# EAGLE design test1 (EAGLE 6.5.0)
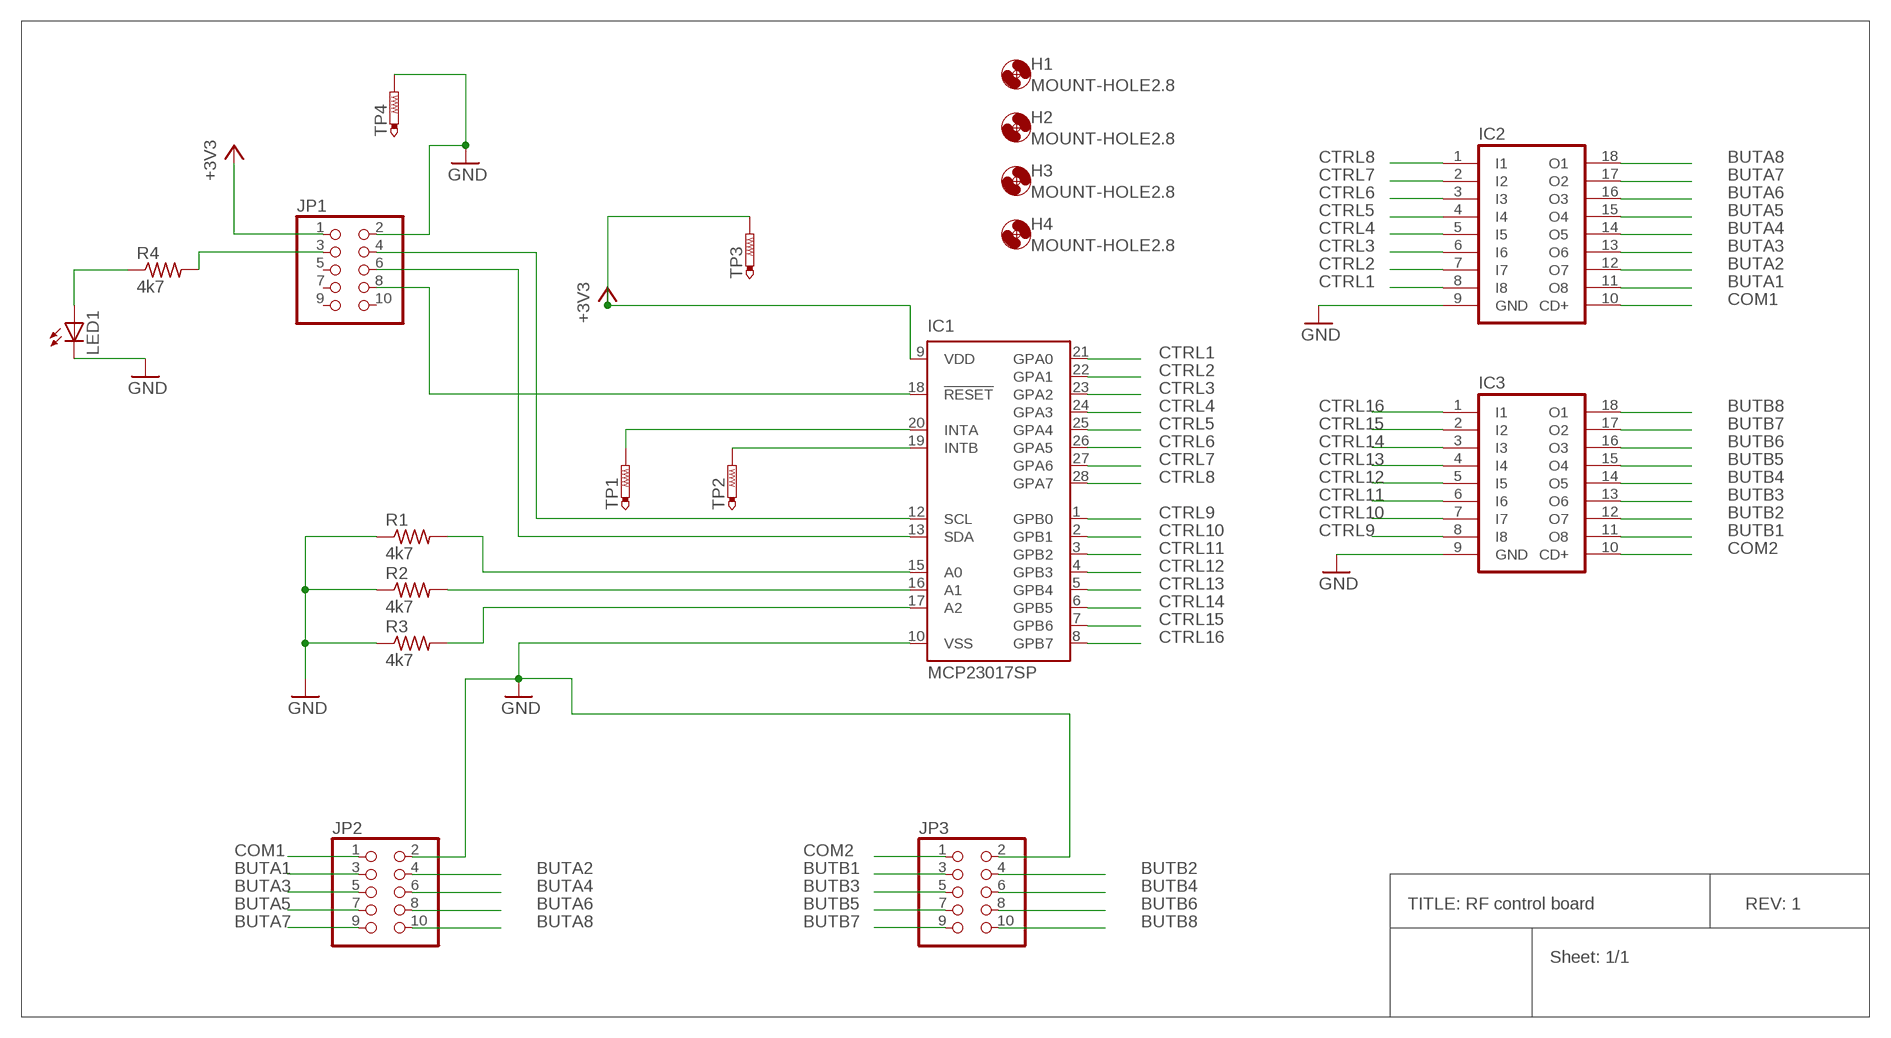
[diagram p0: schematic, sheet 1]

## Parts
H1  MOUNT-HOLE2.8  [2,8]
H2  MOUNT-HOLE2.8  [2,8]
H3  MOUNT-HOLE2.8  [2,8]
H4  MOUNT-HOLE2.8  [2,8]
IC1  MCP23017SP  [DIL28-3]
IC2  ULN2803A  [DIL18]
IC3  ULN2803A  [DIL18]
JP1  PINHD-2X5  [2X05]
JP2  PINHD-2X5  [2X05]
JP3  PINHD-2X5  [2X05]
LED1  LED5MM  [LED5MM]
R1  4k7  R-US_0207/2V  [0207/2V]
R2  4k7  R-US_0207/2V  [0207/2V]
R3  4k7  R-US_0207/2V  [0207/2V]
R4  4k7  R-US_0207/2V  [0207/2V]
TP1  PTR1B2,54  [B2,54]
TP2  PTR1B2,54  [B2,54]
TP3  PTR1B2,54  [B2,54]
TP4  PTR1B2,54  [B2,54]

## Nets
+3V3: IC1.9(VDD) JP1.1 TP3.TP
BUTA1: IC2.11(O8) JP2.3
BUTA2: IC2.12(O7) JP2.4
BUTA3: IC2.13(O6) JP2.5
BUTA4: IC2.14(O5) JP2.6
BUTA5: IC2.15(O4) JP2.7
BUTA6: IC2.16(O3) JP2.8
BUTA7: IC2.17(O2) JP2.9
BUTA8: IC2.18(O1) JP2.10
BUTB1: IC3.11(O8) JP3.3
BUTB2: IC3.12(O7) JP3.4
BUTB3: IC3.13(O6) JP3.5
BUTB4: IC3.14(O5) JP3.6
BUTB5: IC3.15(O4) JP3.7
BUTB6: IC3.16(O3) JP3.8
BUTB7: IC3.17(O2) JP3.9
BUTB8: IC3.18(O1) JP3.10
COM1: IC2.10(CD+) JP2.1
COM2: IC3.10(CD+) JP3.1
CTRL1: IC1.21(GPA0) IC2.8(I8)
CTRL2: IC1.22(GPA1) IC2.7(I7)
CTRL3: IC1.23(GPA2) IC2.6(I6)
CTRL4: IC1.24(GPA3) IC2.5(I5)
CTRL5: IC1.25(GPA4) IC2.4(I4)
CTRL6: IC1.26(GPA5) IC2.3(I3)
CTRL7: IC1.27(GPA6) IC2.2(I2)
CTRL8: IC1.28(GPA7) IC2.1(I1)
CTRL9: IC1.1(GPB0) IC3.8(I8)
CTRL10: IC1.2(GPB1) IC3.7(I7)
CTRL11: IC1.3(GPB2) IC3.6(I6)
CTRL12: IC1.4(GPB3) IC3.5(I5)
CTRL13: IC1.5(GPB4) IC3.4(I4)
CTRL14: IC1.6(GPB5) IC3.3(I3)
CTRL15: IC1.7(GPB6) IC3.2(I2)
CTRL16: IC1.8(GPB7) IC3.1(I1)
GND [ground]: IC1.10(VSS) IC2.9(GND) IC3.9(GND) JP1.2 JP2.2 JP3.2 LED1.K(C) R1.1 R2.1 R3.1 TP4.TP
N$1: IC1.13(SDA) JP1.6
N$2: IC1.12(SCL) JP1.4
N$3: IC1.15(A0) R1.2
N$4: IC1.16(A1) R2.2
N$5: IC1.17(A2) R3.2
N$6: IC1.18(!RESET) JP1.8
N$7: JP1.3 R4.2
N$8: LED1.A R4.1
N$9: IC1.20(INTA) TP1.TP
N$10: IC1.19(INTB) TP2.TP
Unconnected: JP1.5 JP1.7 JP1.9 JP1.10

## Notes on the sheet
- TITLE: RF control board | REV: 1
- Sheet: 1/1

## Library data of the parts
H1-H4 = holes:MOUNT-HOLE: MOUNTING HOLE with drill center marker
IC1 = adafruit:MCP23017: http://ww1.microchip.com/downloads/en/DeviceDoc/21952a.pdf Source: http://ww1.microchip.com/downloads/en/DeviceDoc/21952a.pdf
IC2 IC3 = uln-udn:ULN2803A: DRIVER ARRAY
JP1-JP3 = pinhead:PINHD-2X5: PIN HEADER
LED1 = adafruit:LED: LED OSRAM: - CHIPLED LG R971, LG N971, LY N971, LG Q971, LY Q971, LO R971, LY R971 LH N974, LH R974 LS Q976, LO Q976, LY Q976 LO Q996 - Hyper CHIPLED LW Q18S LB Q993, LB Q99A, LB R99A - SideLED LS A670, LO A670, LY A670, LG A670, LP A670 LB A673, LV A673, LT A673, LW A673 LH A674 LY A675 LS A676, LA A676, LO A676, LY A676, LW A676 LS A679, LY A679, LG A679 - Hyper Micro SIDELED® LS Y876, LA Y876, LO Y876, LY Y876 LT Y87S - SmartLED LW L88C, LW L88S LB L89C, LB L89S, LG L890 LS L89K, LO L89K, LY L89K LS L896, LA L896, LO L896, LY L896 - TOPLED LS T670, LO T670, LY T670, LG T670, LP T670 LSG T670, LSP T670, LSY T670, LOP T670, LYG T670 LG T671, LOG T671, LSG T671 LB T673, LV T673, LT T673, LW T673 LH T674 LS T676, LA T676, LO T676, LY T676, LB T676, LH T676, LSB T676, LW T676 LB T67C, LV T67C, LT T67C, LS T67K, LO T67K, LY T67K, LW E67C LS E67B, LA E67B, LO E67B, LY E67B, LB E67C, LV E67C, LT E67C LW T67C LS T679, LY T679, LG T679 LS T770, LO T770, LY T770, LG T770, LP T770 LB T773, LV T773, LT T773, LW T773 LH T774 LS E675, LA E675, LY E675, LS T675 LS T776, LA T776, LO T776, LY T776, LB T776 LHGB T686 LT T68C, LB T68C - Hyper Mini TOPLED® LB M676 - Mini TOPLED Santana® LG M470 LS M47K, LO M47K, LY M47K Source: http://www.osram.convergy.de/
R1-R4 = adafruit:R-US_: RESISTOR, American symbol
TP1-TP4 = testpad:PTR1: TEST PIN

## Net classes
0 default: width 0.406 mm
1 ground: width 0.508 mm

## Board
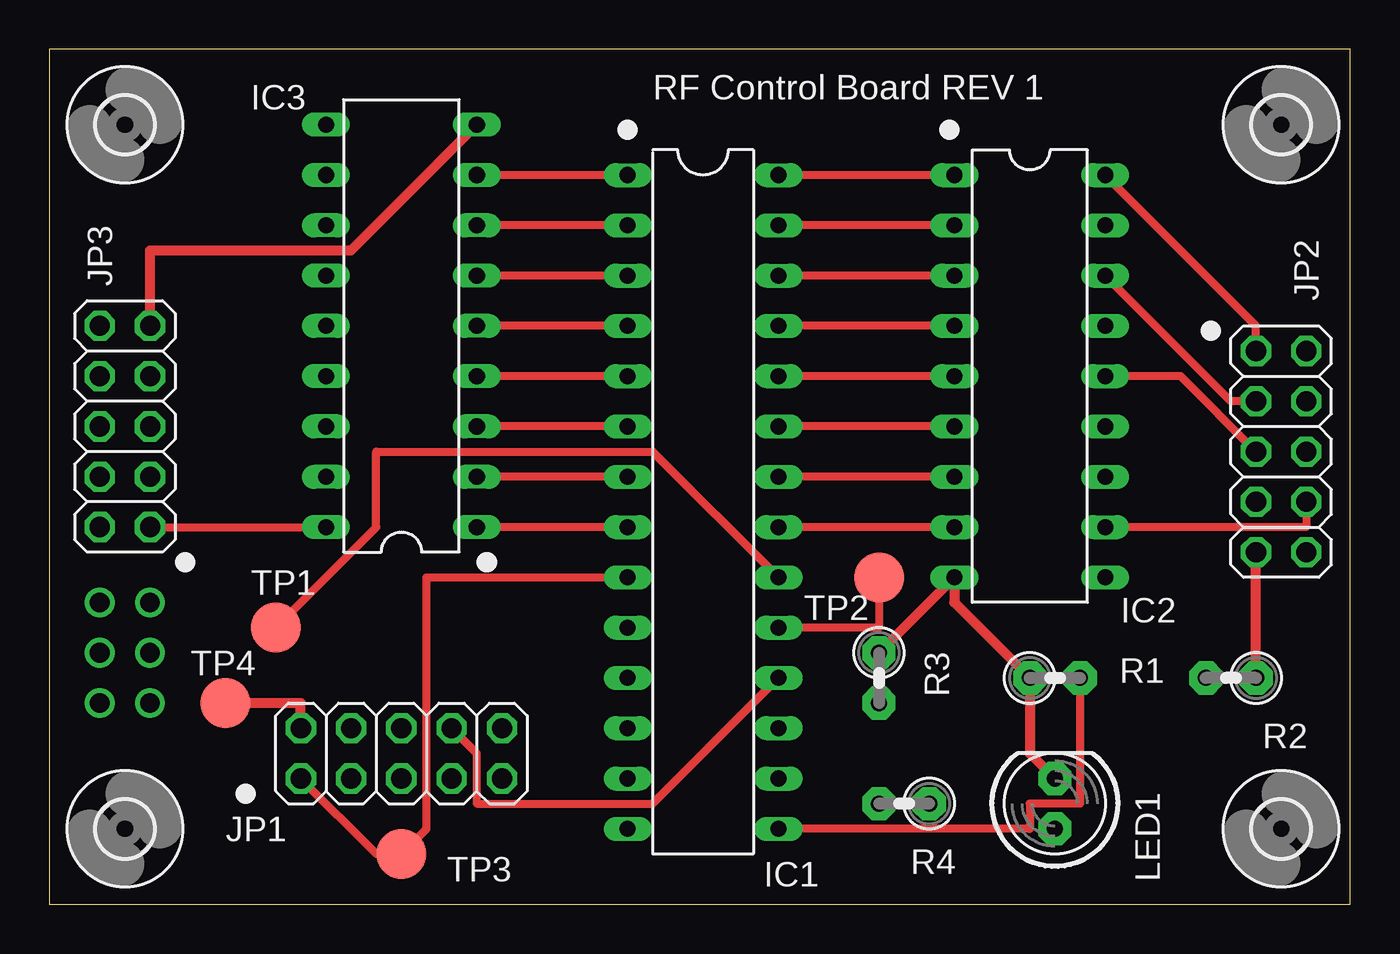
[diagram p1: board, top side]
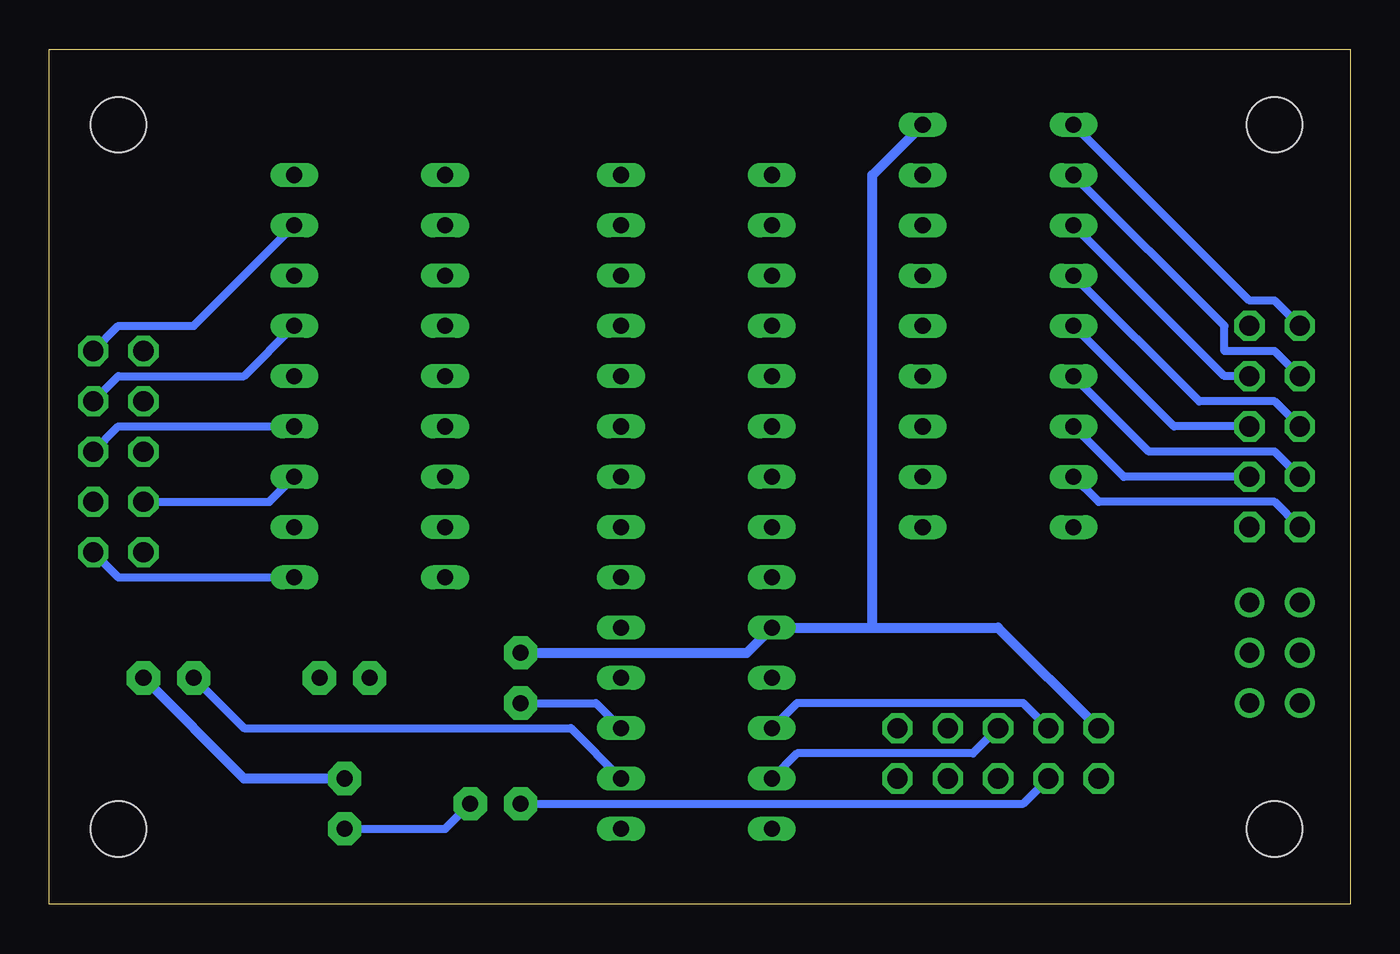
[diagram p2: board, bottom side, seen from below]

Size 65.71 x 43.17 mm. Coordinates in mm from the lower left corner, seen from the top.
Outline: 0,0 65.71,0 65.71,43.17 0,43.17 0,0
Copper layers (1*16): Top 0.0356mm / dielectric 1.5011mm / Bottom 0.0356mm
Design rules "LaenPCBOrder *": minimum track width 6mil, minimum drill 13mil, track to track 8mil, track to pad 8mil, pad to pad 8mil, via to via 8mil, smd to smd 6mil, copper to edge 15mil, drill to drill 6mil, minimum pad ring 7mil, minimum via ring 7mil, stop-mask expansion 3mil, vias tented up to drill 0mil, thermal gap 10mil

### Footprints (pad centres in the part's own frame; a part is rotated, then mirrored left to right if it is on the bottom)
2,8 = hole 2.8: 0,0
DIL28-3 = drill 0.813 long: 1 -16.51,-3.81; 2 -13.97,-3.81; 3 -11.43,-3.81; 4 -8.89,-3.81; 5 -6.35,-3.81; 6 -3.81,-3.81; 7 -1.27,-3.81; 8 1.27,-3.81; 9 3.81,-3.81; 10 6.35,-3.81; 11 8.89,-3.81; 12 11.43,-3.81; 13 13.97,-3.81; 14 16.51,-3.81; 15 16.51,3.81; 16 13.97,3.81; 17 11.43,3.81; 18 8.89,3.81; 19 6.35,3.81; 20 3.81,3.81; 21 1.27,3.81; 22 -1.27,3.81; 23 -3.81,3.81; 24 -6.35,3.81; 25 -8.89,3.81; 26 -11.43,3.81; 27 -13.97,3.81; 28 -16.51,3.81
DIL18 = drill 0.813 long: 1 -10.16,-3.81; 2 -7.62,-3.81; 3 -5.08,-3.81; 4 -2.54,-3.81; 5 0,-3.81; 6 2.54,-3.81; 7 5.08,-3.81; 8 7.62,-3.81; 9 10.16,-3.81; 10 10.16,3.81; 11 7.62,3.81; 12 5.08,3.81; 13 2.54,3.81; 14 0,3.81; 15 -2.54,3.81; 16 -5.08,3.81; 17 -7.62,3.81; 18 -10.16,3.81
2X05 = drill 1.016 octagon: 1 -5.08,-1.27; 2 -5.08,1.27; 3 -2.54,-1.27; 4 -2.54,1.27; 5 0,-1.27; 6 0,1.27; 7 2.54,-1.27; 8 2.54,1.27; 9 5.08,-1.27; 10 5.08,1.27
LED5MM = drill 0.813 pad 1.676 octagon: A -1.27,0; K 1.27,0
0207/2V = drill 0.813 pad 1.676 octagon: 1 -1.27,0; 2 1.27,0
B2,54 = smd 2.54 x 2.54: TP 0,0

### Placement (x,y rotation side)
H1  62.23,39.37 0 top
H2  62.23,3.81 0 top
H3  3.81,3.81 0 top
H4  3.81,39.37 0 top
IC1  33.02,20.32 270 top
IC2  49.53,26.67 270 top
IC3  17.78,29.21 90 top
JP1  17.78,7.62 0 top
JP2  62.23,22.86 90 top
JP3  3.81,24.13 270 top
LED1  50.8,5.08 90 top
R1  50.8,11.43 0 top
R2  59.69,11.43 180 top
R3  41.91,11.43 270 top
R4  43.18,5.08 180 top
TP1  11.43,13.97 0 top
TP2  41.91,16.51 0 top
TP3  17.78,2.54 0 top
TP4  8.89,10.16 0 top

### Tracks (layer width: path | path; a pad name or v marks a point on that pad's centre or on a via)
+3V3
  Top 0.406: IC1.9 19.05,16.51 19.05,3.81 TP3.TP 16.51,2.54 JP1.1
BUTA1
  Top 0.406: IC2.11 63.5,19.05 JP2.3
BUTA2
  Bottom 0.406: IC2.12 54.61,20.32 JP2.4
BUTA3
  Bottom 0.406: IC2.13 62.23,24.13 JP2.5
BUTA4
  Top 0.406: IC2.14 57.15,26.67 JP2.6
BUTA5
  Bottom 0.406: IC2.15 55.88,26.67 62.23,26.67 JP2.7
BUTA6
  Top 0.406: IC2.16 59.69,25.4 JP2.8
BUTA7
  Bottom 0.406: IC2.17 58.42,29.21 62.23,29.21 JP2.9
BUTA8
  Top 0.406: IC2.18 60.96,29.21 JP2.10
BUTB1
  Bottom 0.406: IC3.11 6.35,29.21 6.35,27.94 3.81,27.94 JP3.3
BUTB2
  Bottom 0.406: IC3.12 6.35,26.67 JP3.4
BUTB3
  Bottom 0.406: IC3.13 7.62,25.4 3.81,25.4 JP3.5
BUTB4
  Bottom 0.406: IC3.14 8.89,24.13 JP3.6
BUTB5
  Bottom 0.406: IC3.15 10.16,22.86 3.81,22.86 JP3.7
BUTB6
  Bottom 0.406: IC3.16 11.43,21.59 JP3.8
BUTB7
  Bottom 0.406: IC3.17 12.7,20.32 3.81,20.32 JP3.9
BUTB8
  Top 0.406: JP3.10 IC3.18
COM1
  Bottom 0.406: IC2.10 62.23,16.51 JP2.1
COM2
  Bottom 0.406: IC3.10 5.08,30.48 3.81,30.48 JP3.1
CTRL1
  Top 0.406: IC2.8 IC1.21
CTRL2
  Top 0.406: IC2.7 IC1.22
CTRL3
  Top 0.406: IC2.6 IC1.23
CTRL4
  Top 0.406: IC2.5 IC1.24
CTRL5
  Top 0.406: IC2.4 IC1.25
CTRL6
  Top 0.406: IC2.3 IC1.26
CTRL7
  Top 0.406: IC2.2 IC1.27
CTRL8
  Top 0.406: IC2.1 IC1.28
CTRL9
  Top 0.406: IC1.1 IC3.8
CTRL10
  Top 0.406: IC1.2 IC3.7
CTRL11
  Top 0.406: IC1.3 IC3.6
CTRL12
  Top 0.406: IC1.4 IC3.5
CTRL13
  Top 0.406: IC1.5 IC3.4
CTRL14
  Top 0.406: IC1.6 IC3.3
CTRL15
  Top 0.406: IC1.7 IC3.2
CTRL16
  Top 0.406: IC1.8 IC3.1
GND
  Top 0.508: IC3.9 15.24,33.02 5.08,33.02 JP3.2 | TP4.TP 12.7,10.16 JP1.2 | R3.1 IC2.9 45.72,15.24 R1.1 49.53,7.62 LED1.K | R2.1 JP2.2
  Bottom 0.508: R3.1 30.48,12.7 IC1.10 24.13,13.97 | JP1.2 17.78,13.97 24.13,13.97 | IC3.9 24.13,36.83 24.13,13.97 | R2.1 55.88,6.35 LED1.K
N$1
  Bottom 0.406: IC1.13 27.94,7.62 19.05,7.62 JP1.6
N$2
  Bottom 0.406: IC1.12 27.94,10.16 16.51,10.16 JP1.4
N$3
  Top 0.406: IC1.15 49.53,3.81 49.53,5.08 52.07,5.08 R1.2
N$4
  Bottom 0.406: IC1.16 39.37,8.89 55.88,8.89 R2.2
N$5
  Bottom 0.406: IC1.17 38.1,10.16 R3.2
N$6
  Top 0.406: IC1.18 30.48,5.08 21.59,5.08 21.59,7.62 JP1.8
N$7
  Bottom 0.406: JP1.3 16.51,5.08 R4.2
N$8
  Bottom 0.406: R4.1 45.72,3.81 LED1.A
N$9
  Top 0.406: IC1.20 30.48,22.86 16.51,22.86 16.51,19.05 TP1.TP
N$10
  Top 0.406: IC1.19 41.91,13.97 TP2.TP
N$11  (via drill 1 pad 1.02)
  other vias: 5.08,12.7
N$12  (via drill 1 pad 1.02)
  other vias: 2.54,12.7
N$13  (via drill 1 pad 1.02)
  other vias: 5.08,15.24
N$14  (via drill 1 pad 1.02)
  other vias: 2.54,15.24
N$15  (via drill 1 pad 1.02)
  other vias: 2.54,10.16
N$16  (via drill 1 pad 1.02)
  other vias: 5.08,10.16

### Text on the board
tNames: RF Control Board REV 1